# Altium schematic sheet DC-DC_Regulator.SchDoc
size A4
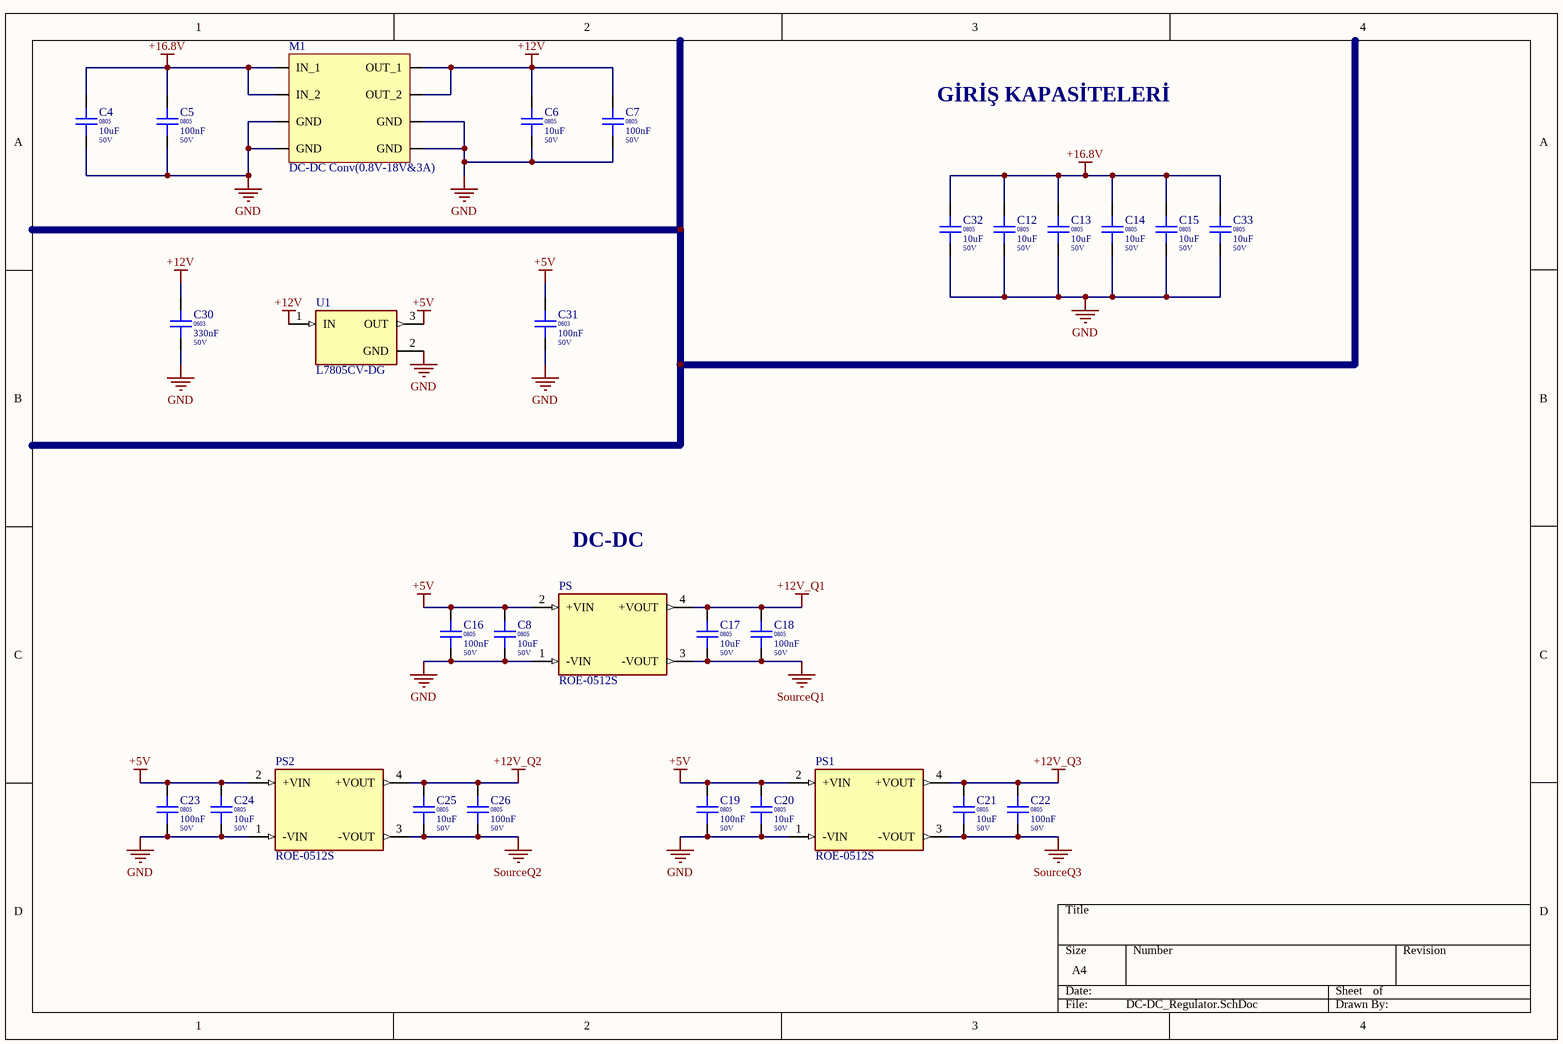
[diagram p0: DC-DC_Regulator.SchDoc]

## Parts
C4  Package / Case: 0805  Voltage: 50V  [CAPC 0805]  (hidden comment: 10uF)
C5  Package / Case: 0805  Voltage: 50V  [CAPC 0805]  (hidden comment: 100nF)
C6  Package / Case: 0805  Voltage: 50V  [CAPC 0805]  (hidden comment: 10uF)
C7  Package / Case: 0805  Voltage: 50V  [CAPC 0805]  (hidden comment: 100nF)
C8  Package / Case: 0805  Voltage: 50V  [CAPC 0805]  (hidden comment: 10uF)
C12  Package / Case: 0805  Voltage: 50V  [CAPC 0805]  (hidden comment: 10uF)
C13  Package / Case: 0805  Voltage: 50V  [CAPC 0805]  (hidden comment: 10uF)
C14  Package / Case: 0805  Voltage: 50V  [CAPC 0805]  (hidden comment: 10uF)
C15  Package / Case: 0805  Voltage: 50V  [CAPC 0805]  (hidden comment: 10uF)
C16  Package / Case: 0805  Voltage: 50V  [CAPC 0805]  (hidden comment: 100nF)
C17  Package / Case: 0805  Voltage: 50V  [CAPC 0805]  (hidden comment: 10uF)
C18  Package / Case: 0805  Voltage: 50V  [CAPC 0805]  (hidden comment: 100nF)
C19  Package / Case: 0805  Voltage: 50V  [CAPC 0805]  (hidden comment: 100nF)
C20  Package / Case: 0805  Voltage: 50V  [CAPC 0805]  (hidden comment: 10uF)
C21  Package / Case: 0805  Voltage: 50V  [CAPC 0805]  (hidden comment: 10uF)
C22  Package / Case: 0805  Voltage: 50V  [CAPC 0805]  (hidden comment: 100nF)
C23  Package / Case: 0805  Voltage: 50V  [CAPC 0805]  (hidden comment: 100nF)
C24  Package / Case: 0805  Voltage: 50V  [CAPC 0805]  (hidden comment: 10uF)
C25  Package / Case: 0805  Voltage: 50V  [CAPC 0805]  (hidden comment: 10uF)
C26  Package / Case: 0805  Voltage: 50V  [CAPC 0805]  (hidden comment: 100nF)
C30  Package / Case: 0603  Voltage: 50V  [CAPC 0603]  (hidden comment: 330nF)
C31  Package / Case: 0603  Voltage: 50V  [CAPC 0603]  (hidden comment: 100nF)
C32  Package / Case: 0805  Voltage: 50V  [CAPC 0805]  (hidden comment: 10uF)
C33  Package / Case: 0805  Voltage: 50V  [CAPC 0805]  (hidden comment: 10uF)
M1  DC-DC Conv(0.8V-18V&3A)  [mp]
PS  ROE-0512S  [CONV_ROE-0512S]
PS1  ROE-0512S  [CONV_ROE-0512S]
PS2  ROE-0512S  [CONV_ROE-0512S]
U1  L7805CV-DG  [TO255P1040X460X2890-3]

## Nets
+5V: C8.2 C16.2 C19.2 C20.2 C23.2 C24.2 C31.2 PS.2(+VIN) PS1.2(+VIN) PS2.2(+VIN) U1.3(OUT)
+12V: C6.2 C7.2 C30.2 M1.3(OUT_1) M1.4(OUT_2) U1.1(IN)
+12V_Q1: C17.2 C18.2 PS.4(+VOUT)
+12V_Q2: C25.2 C26.2 PS2.4(+VOUT)
+12V_Q3: C21.2 C22.2 PS1.4(+VOUT)
+16.8V: C4.2 C5.2 C12.2 C13.2 C14.2 C15.2 C32.2 C33.2 M1.1(IN_1) M1.2(IN_2)
GND: C4.1 C5.1 C6.1 C7.1 C8.1 C12.1 C13.1 C14.1 C15.1 C16.1 C19.1 C20.1 C23.1 C24.1 C30.1 C31.1 C32.1 C33.1 M1.5(GND) M1.6(GND) M1.7(GND) M1.8(GND) PS.1(-VIN) PS1.1(-VIN) PS2.1(-VIN) U1.2(GND)
SourceQ1: C17.1 C18.1 PS.3(-VOUT)
SourceQ2: C25.1 C26.1 PS2.3(-VOUT)
SourceQ3: C21.1 C22.1 PS1.3(-VOUT)

## Notes on the sheet
- GİRİŞ KAPASİTELERİ
- DC-DC

## Library data of the parts
C4 C6 C12-C15 C32 C33 = CAPC0588: Capacitor Ceramic 10uF 50V 0805; Value Rating: uF; Value: 10uF; Part Number: CAPC0588; Category: Capacitor Ceramic; Values: 10uF 50V
C5 C7 C16 C18 C19 C22 C23 C26 = CAPC0572: Capacitor Ceramic 100nF 50V 0805; Value Rating: nF; Favorites: Favorite; Value: 100nF; Part Number: CAPC0572; Category: Capacitor Ceramic; Values: 100nF 50V
C8 C17 C20 C21 C24 C25 = CAPC0588: Capacitor Ceramic 10uF 50V 0805; Tolerance: %10; Value Rating: uF; Value: 10uF; Part Number: CAPC0588; Category: Capacitor Ceramic; Values: 10uF 50V
C30 = CAPC0288: Capacitor Ceramic 330nF 50V 0603; Tolerance: %10; Value Rating: nF; Value: 330nF; Part Number: CAPC0288; Category: Capacitor Ceramic; Values: 330nF 50V
C31 = CAPC0285: Capacitor Ceramic 100nF 50V 0603; Tolerance: %10; Value Rating: nF; Favorites: Favorite; Value: 100nF; Part Number: CAPC0285; Category: Capacitor Ceramic; Values: 100nF 50V
M1 = MP1584EN
PS PS1 PS2 = ROE-0512S: 1W DC/DC-Converter 'ECONOLINE' SIP4 1kV unreg; MF: Recom Power; MP: ROE-0512S; SnapEDA_Link: https://www.snapeda.com/parts/ROE-0512S/Recom%20Power/view-part/2768892/?ref=snap; Price: None; Availability: Unavailable; Package: SIP-4 Recom Power; Value: *
U1 = L7805CV-DG: Linear Voltage Regulator IC Positive Fixed 1 Output 1.5A TO-220; MF: STMicroelectronics; Value: *; Availability: In Stock; Price: None; SnapEDA_Link: https://www.snapeda.com/parts/L7805CV-DG/STMicroelectronics/view-part/?ref=snap; Check_prices: https://www.snapeda.com/parts/L7805CV-DG/STMicroelectronics/view-part/?ref=eda; Purchase-URL: https://pricing.snapeda.com/search/part/L7805CV-DG/?ref=eda; Package: TO-220 STMicroelectronics; MP: L7805CV-DG